# EAGLE design otb-8266 (EAGLE 7.4.0)
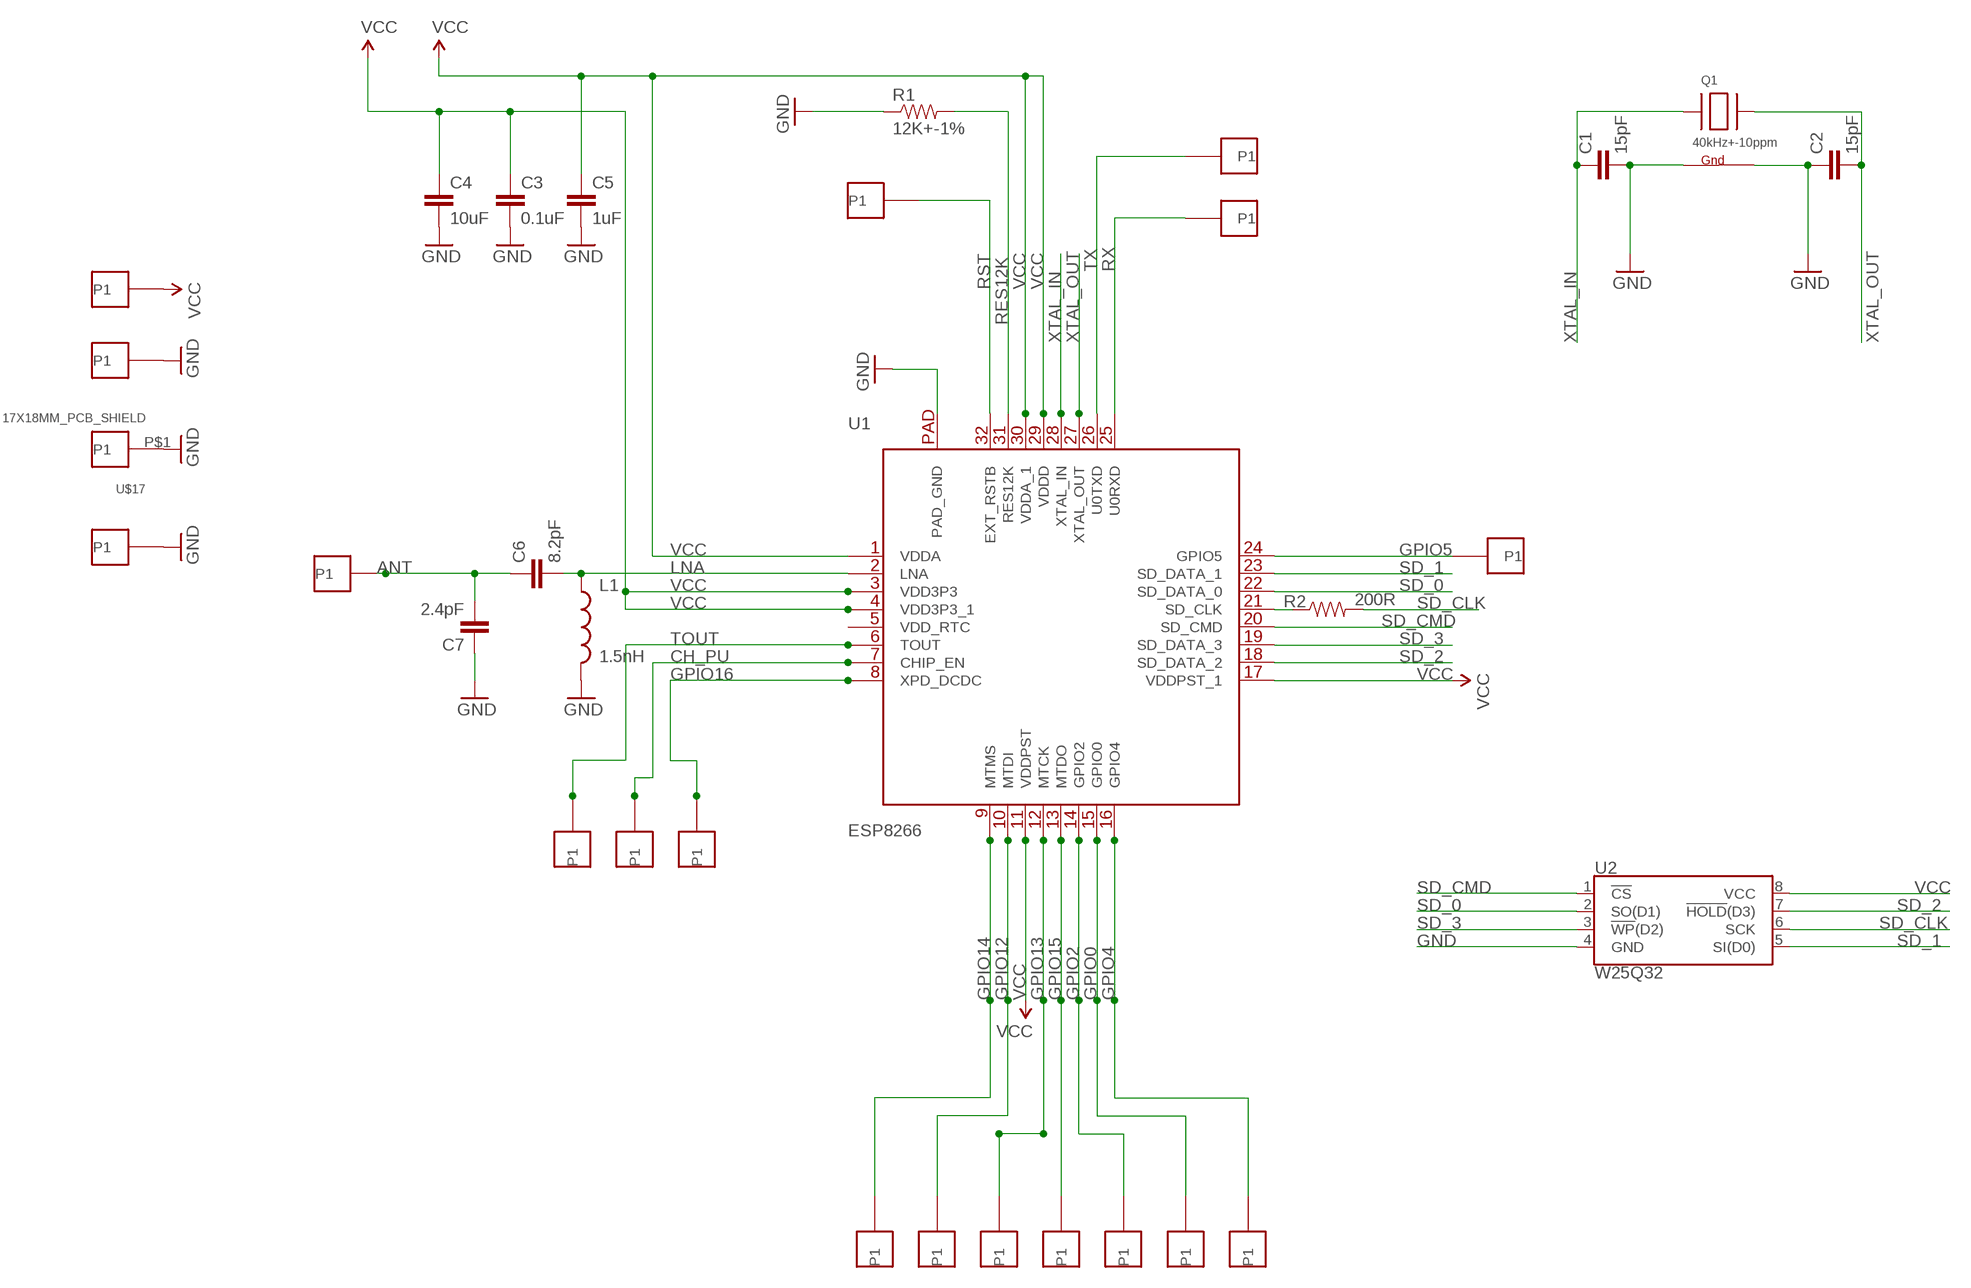
[diagram p0: schematic, sheet 1]

## Parts
C1  15pF  CAP0402-CAP  [0402-CAP]
C2  15pF  CAP0402-CAP  [0402-CAP]
C3  0.1uF  CAP0402-CAP  [0402-CAP]
C4  10uF  CAP0603-CAP  [0603-CAP]
C5  1uF  CAP0603-CAP  [0603-CAP]
C6  8.2pF  CAP0402-CAP  [0402-CAP]
C7  2.4pF  CAP0402-CAP  [0402-CAP]
L1  1.5nH  INDUCTOR0402  [C0402]
Q1  40kHz+-10ppm  XTAL-4-3225  [NX3225]
R1  12K+-1%  RESISTOR0402-RES  [0402-RES]
R2  200R  RESISTOR0402-RES  [0402-RES]
U1  ESP8266  [QFN32]
U2  W25Q32  W25Q32FVSS  [SOIC-8]
U$1  1.27MM_PITCH_PLATED_HOLE  [1.27MM_PITCH_PLATED_HOLE]
U$2  1.27MM_PITCH_PLATED_HOLE  [1.27MM_PITCH_PLATED_HOLE]
U$3  1.27MM_PITCH_PLATED_HOLE  [1.27MM_PITCH_PLATED_HOLE]
U$4  1.27MM_PITCH_PLATED_HOLE  [1.27MM_PITCH_PLATED_HOLE]
U$5  1.27MM_PITCH_PLATED_HOLE  [1.27MM_PITCH_PLATED_HOLE]
U$6  1.27MM_PITCH_PLATED_HOLE  [1.27MM_PITCH_PLATED_HOLE]
U$7  1.27MM_PITCH_PLATED_HOLE  [1.27MM_PITCH_PLATED_HOLE]
U$8  1.27MM_PITCH_PLATED_HOLE  [1.27MM_PITCH_PLATED_HOLE]
U$9  1.27MM_PITCH_PLATED_HOLE  [1.27MM_PITCH_PLATED_HOLE]
U$10  1.27MM_PITCH_PLATED_HOLE  [1.27MM_PITCH_PLATED_HOLE]
U$11  1.27MM_PITCH_PLATED_HOLE  [1.27MM_PITCH_PLATED_HOLE]
U$12  1.27MM_PITCH_PLATED_HOLE  [1.27MM_PITCH_PLATED_HOLE]
U$13  1.27MM_PITCH_PLATED_HOLE  [1.27MM_PITCH_PLATED_HOLE]
U$14  1.27MM_PITCH_PLATED_HOLE  [1.27MM_PITCH_PLATED_HOLE]
U$15  1.27MM_PITCH_PLATED_HOLE  [1.27MM_PITCH_PLATED_HOLE]
U$16  1.27MM_PITCH_PLATED_HOLE  [1.27MM_PITCH_PLATED_HOLE]
U$17  17X18MM_PCB_SHIELD  [17X18_SHIELD]
U$18  1.27MM_PITCH_PLATED_HOLE  [1.27MM_PITCH_PLATED_HOLE]
U$19  1.27MM_PITCH_PLATED_HOLE  [1.27MM_PITCH_PLATED_HOLE]

## Nets
ANT: C6.1 C7.2 U$16.P1
CH_PU: U1.7(CHIP_EN) U$4.P1
GND: C1.2 C2.1 C3.2 C4.2 C5.2 C7.1 L1.2 Q1.2(G2) Q1.4(G1) R1.1 U1.EP(PAD_GND) U2.4(GND) U$2.P1 U$17.P$1(P1) U$19.P1
GPIO0: U1.15(GPIO0) U$11.P1
GPIO2: U1.14(GPIO2) U$10.P1
GPIO4: U1.16(GPIO4) U$12.P1
GPIO5: U1.24(GPIO5) U$18.P1
GPIO12: U1.10(MTDI) U$7.P1
GPIO13: U1.12(MTCK) U$8.P1
GPIO14: U1.9(MTMS) U$6.P1
GPIO15: U1.13(MTDO) U$9.P1
GPIO16: U1.8(XPD_DCDC) U$5.P1
LNA: C6.2 L1.1 U1.2(LNA)
N$2: R2.1 U1.21(SD_CLK)
RES12K: R1.2 U1.31(RES12K)
RST: U1.32(EXT_RSTB) U$15.P1
RX: U1.25(U0RXD) U$13.P1
SD_0: U1.22(SD_DATA_0) U2.2(SO(D1))
SD_1: U1.23(SD_DATA_1) U2.5(SI(D0))
SD_2: U1.18(SD_DATA_2) U2.7(!HOLD!(D3))
SD_3: U1.19(SD_DATA_3) U2.3(!WP!(D2))
SD_CLK: R2.2 U2.6(SCK)
SD_CMD: U1.20(SD_CMD) U2.1(!CS!)
TOUT: U1.6(TOUT) U$3.P1
TX: U1.26(U0TXD) U$14.P1
VCC: C3.1 C4.1 C5.1 U1.1(VDDA) U1.3(VDD3P3) U1.4(VDD3P3_1) U1.11(VDDPST) U1.17(VDDPST_1) U1.29(VDDD) U1.30(VDDA_1) U2.8(VCC) U$1.P1
XTAL_IN: C1.1 Q1.1(X1) U1.28(XTAL_IN)
XTAL_OUT: C2.2 Q1.3(X2) U1.27(XTAL_OUT)
Unconnected: U1.5(VDD_RTC)

## Library data of the parts
C1-C3 C6 C7 = SparkFun-Passives:CAP: Capacitor Standard 0603 ceramic capacitor, and 0.1" leaded capacitor.
C4 C5 = SparkFun-Capacitors:CAP: Capacitor Standard 0603 ceramic capacitor, and 0.1" leaded capacitor.
L1 = SparkFun-Passives:INDUCTOR: Inductors Basic Inductor/Choke - 0603 and 1206. Footprints are not proven and vary greatly between part numbers. INDUCTOR POWER 3.3UH 4.0A SMD 0.197" L x 0.197" W x 0.177" H (5.00mm x 5.00mm x 4.50mm)
Q1 = adafruit:XTAL-4: Classic 4-pin 3.2 x 2.5mm crystal
R1 R2 = SparkFun-Passives:RESISTOR: Resistor Basic schematic elements and footprints for 0603, 1206, and PTH resistors.
U1 = Piers's library:ESP8266: Espressif ESP8266 WiFi Smart Connectivity Platform.; PROD_ID: IC-12452
U2 = SparkFun-DigitalIC:W25Q32FV: Winbond W25Q32FV 32Mbit (4MB) Flash The W25Q32FV support the standard Serial Peripheral Interface (SPI), Dual/Quad I/O SPI as well as 2-clocks instruction cycle Quad Peripheral Interface (QPI). Datasheet <http://www.winbond.com/resource-files/w25q32fv%20revh%20091613.pdf>; PROD_ID: IC-13229
U$1-U$16 U$18 U$19 = Piers's library:1.27MM_PITCH_PLATED_HOLE
U$17 = Piers's library:17X18MM_PCB_SHIELD

## Board
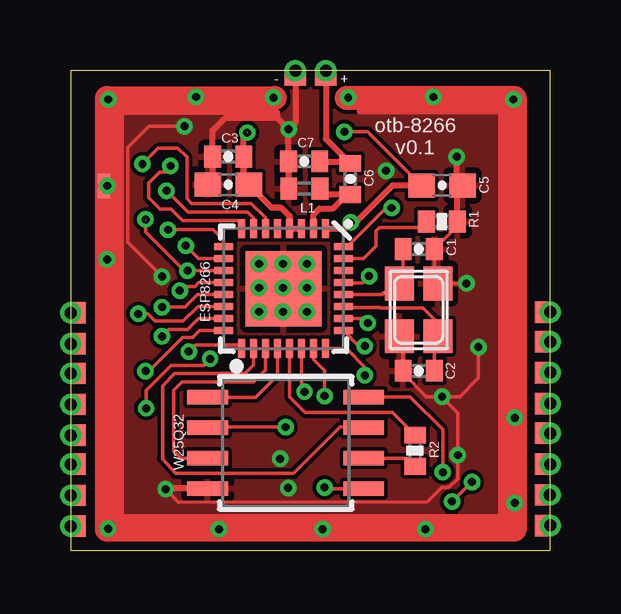
[diagram p1: board, top side]
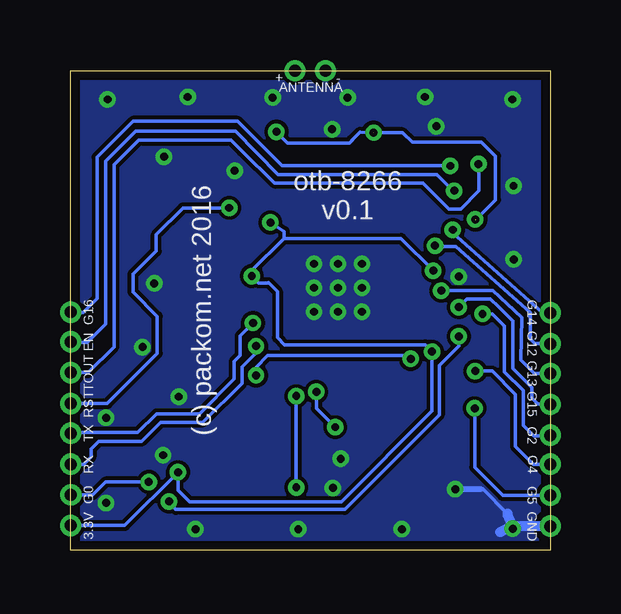
[diagram p2: board, bottom side, seen from below]

Size 20 x 20 mm. Coordinates in mm from the lower left corner, seen from the top.
Outline: 0,0 20,0 20,20 0,20 0,0
Copper layers (1*16): Top 0.0356mm / dielectric 1.5011mm / Bottom 0.0356mm
Design rules "LaenPCBOrder": minimum track width 6mil, minimum drill 13mil, track to track 6mil, track to pad 6mil, pad to pad 6mil, via to via 6mil, smd to smd 6mil, copper to edge 15mil, drill to drill 6mil, minimum pad ring 7mil, minimum via ring 7mil, stop-mask expansion 3mil, vias tented up to drill 0mil, thermal gap 10mil

### Footprints (pad centres in the part's own frame; a part is rotated, then mirrored left to right if it is on the bottom)
0402-CAP = smd 0.7 x 0.9: 1 -0.65,0; 2 0.65,0
0603-CAP = smd 1.1 x 1: 1 -0.85,0; 2 0.85,0
C0402 = smd 0.7 x 0.9: 1 -0.65,0; 2 0.65,0
NX3225 = smd 1.4 x 1.2: 1 -1.1,-0.8; 2 1.1,-0.8; 3 1.1,0.8; 4 -1.1,0.8
0402-RES = smd 0.7 x 0.9: 1 -0.65,0; 2 0.65,0
QFN32 = smd 0.8 x 0.285: 1 -2.5,1.75; 2 -2.5,1.25; 3 -2.5,0.75; 4 -2.5,0.25; 5 -2.5,-0.25; 6 -2.5,-0.75; 7 -2.5,-1.25; 8 -2.5,-1.75; 17 2.5,-1.75; 18 2.5,-1.25; 19 2.5,-0.75; 20 2.5,-0.25; 21 2.5,0.25; 22 2.5,0.75; 23 2.5,1.25; 24 2.5,1.75 | smd 0.285 x 0.8: 9 -1.75,-2.5; 10 -1.25,-2.5; 11 -0.75,-2.5; 12 -0.25,-2.5; 13 0.25,-2.5; 14 0.75,-2.5; 15 1.25,-2.5; 16 1.75,-2.5; 25 1.75,2.5; 26 1.25,2.5; 27 0.75,2.5; 28 0.25,2.5; 29 -0.25,2.5; 30 -0.75,2.5; 31 -1.25,2.5; 32 -1.75,2.5 | smd 3.15 x 3.15: EP 0,0
SOIC-8 = smd 0.61 x 1.702: 1 -1.905,-3.251; 2 -0.635,-3.251; 3 0.635,-3.251; 4 1.905,-3.251; 5 1.905,3.251; 6 0.635,3.251; 7 -0.635,3.251; 8 -1.905,3.251
1.27MM_PITCH_PLATED_HOLE = drill 0.5 pad 0.889: P1 0,0 | smd 0.635 x 0.889: P$1 0.318,0
17X18_SHIELD = smd 0.508 x 1.016: P$1 -8.62,5.35

### Placement (x,y rotation side)
C1  14.52,12.56 0 top
C2  14.52,7.48 0 top
C3  6.57,16.41 180 top
C4  6.57,15.25 180 top
C5  15.49,15.21 0 top
C6  11.66,15.48 270 top
C7  9.74,16.21 0 top
L1  9.74,15.08 180 top
Q1  14.52,10.02 270 top
R1  15.48,13.7 180 top
R2  14.37,4.15 270 top
U1  8.88,10.91 270 top
U2  8.97,4.47 270 top
U$1  20,1.03 180 top
U$2  0,1 0 top
U$3  20,7.4 180 top
U$4  20,8.69 180 top
U$5  20,9.93 180 top
U$6  0,9.9 0 top
U$7  0,8.61 0 top
U$8  0,7.37 0 top
U$9  0,6.08 0 top
U$10  0,4.79 0 top
U$11  19.99,2.31 180 top
U$12  0,3.59 0 top
U$13  20,3.59 180 top
U$14  20,4.88 180 top
U$15  20,6.11 180 top
U$16  10.64,20 270 top
U$17  10.02,9.85 0 top
U$18  0,2.29 0 top
U$19  9.37,20 270 top

### Tracks (layer width: path | path; a pad name or v marks a point on that pad's centre or on a via)
ANT
  Top 0.254: C7.2 11.57,16.21 C6.1 10.65,17.14 U$16.P1
CH_PU  (via drill 0.33)
  Top 0.152: U1.7 7.63,13.86 7.38,14.11 4.89,14.11 4.76,14.23 v4,14.99
  Bottom 0.152: 4.05,14.99 v4,14.99 4.04,14.99 4.22,15.16 4.73,15.67 11.35,15.67 13.13,17.48 17.3,17.48 18.54,16.23 18.54,9.42 19.3,8.66 19.97,8.66 U$4.P1
GND  (via drill 0.33)
  Top 0.152: C2.1 13.87,8.77 Q1.2 13.79,8.92 13.87,8.84 13.87,7.37 14.83,6.4 v15.49,6.4 | v16.51,11.12 16.5,11.12 Q1.4 15.17,11.27 C1.2 16.13,13.52 R1.1 | v3.96,2.54 4.5,1.99 14.88,2.01 15.49,2.61 15.77,2.62 16.14,2.98 v16.14,3.96 16.14,5.71 15.49,6.38 v15.49,6.4 | v3.81,11.4 2.49,12.75 2.39,12.85 2.39,16.79 3.28,17.68 v4.75,17.68 | v15.49,6.4 16.23,6.4 17,7.18 v17,8.47 | 17.96,1.4 17.96,1.41 v18.52,1.97
  Top 0.254: U2.4 3.99,2.57 v3.96,2.54 | C4.2 5.92,15.44 C3.2 5.92,17.5 6.45,18.03 8.61,18.03 | L1.2 C7.1 9.09,17.58 v9.09,17.55 | C5.2 16.13,15 R1.1 16.13,15.21 16.1,15.24 v16.1,16.41 | 8.61,18.03 v9.09,17.55 | 12.06,18.29 17.96,18.29 17.96,1.4 2.08,1.4 2.08,18.26 8.61,18.26 8.61,18.03 | U$19.P1 9.37,17.83 v9.09,17.55
  Top 0.406: U$17.P$1 1.4,15.35 v1.53,15.19
  Bottom 0.152: 3.94,2.56 v3.96,2.54 | 2.9,2.54 3.98,2.54 3.99,2.53 3.99,2.55 4,2.56 2.82,2.56 1.78,1.52
  Bottom 0.254: 2.9,2.54 v3.96,2.54
  Bottom 0.406: 1.78,1.52 1.59,1.03 2.1,0.75 1.54,1 0.15,1 U$2.P1
  other vias: 7.85,11.94 8.85,11.94 9.85,11.94 9.85,10.94 8.85,10.94 7.85,10.94 7.85,9.94 8.85,9.94 9.85,9.94 1.57,18.8 18.46,18.8 1.56,0.89 10.51,0.87 6.19,0.87 14.8,0.87 18.52,5.52 8.45,18.87 11.57,18.87 15.12,18.9 5.22,18.9 1.52,12.12 13.16,15.82 8.74,3.81 9.07,2.59
  pour Bottom: 0,20 20,20 20,0 0,0
  pour Top: 0,20 20,20 20,19 20,0 0,0
GPIO0  (via drill 0.33)
  Top 0.152: U1.15 5.34,9.66 4.88,9.2 4.09,9.2 v3.81,8.91 | v15.9,2.03 15.93,2.03 v16.74,2.85
  Bottom 0.152: v3.81,8.91 3.81,8.51 4.62,7.7 4.62,5.64 8.56,1.7 15.62,1.7 v15.9,2.03 | v16.74,2.85 18.54,2.85 19.07,2.31 U$11.P1
GPIO2  (via drill 0.33)
  Top 0.152: U1.14 5.31,10.16 4.7,9.55 3.53,9.55 3.23,9.86 v2.82,9.86
  Bottom 0.152: v2.82,9.86 2.41,9.86 1.91,9.35 1.91,7.44 1.12,6.66 1.12,5.21 0.69,4.78 0.02,4.78 U$10.P1
GPIO4  (via drill 0.33)
  Top 0.152: U1.16 5.37,9.16 5.08,8.87 4.67,8.87 3.28,7.47 v3.12,7.47
  Bottom 0.152: v3.12,7.47 2.41,7.47 1.45,6.5 1.45,4.32 0.71,3.58 U$12.P1
GPIO5  (via drill 0.33)
  Top 0.152: U1.24 11.51,8.41 12.27,7.62 v12.27,7.29 | v5.82,7.98 5.56,7.7 4.19,7.7 3.15,6.66 v3.15,5.92
  Bottom 0.152: v12.27,7.29 12.27,7.62 11.79,8.13 5.97,8.13 v5.82,7.98 | v3.15,5.92 3.15,3.45 1.98,2.29 U$18.P1
GPIO12  (via drill 0.33)
  Top 0.152: U1.10 5.34,12.16 v4.8,12.7
  Bottom 0.152: v4.8,12.7 4.8,12.67 3.93,12.67 0.84,9.91 0.84,8.81 0.64,8.61 U$7.P1
GPIO13  (via drill 0.33)
  Top 0.152: U1.12 5.34,11.16 5.18,11 4.72,11 v4.55,10.82
  Bottom 0.152: v4.55,10.82 2.39,10.82 1.19,9.7 1.22,7.92 0.66,7.37 U$8.P1
GPIO14  (via drill 0.33)
  Top 0.152: U1.9 6.38,12.93 5.94,13.36 v4.06,13.36
  Bottom 0.152: v4.06,13.36 4.06,13.22 0.33,9.91 0.33,9.9 U$6.P1
GPIO15  (via drill 0.33)
  Top 0.152: U1.13 5.3,10.66 4.78,10.13 v3.81,10.13
  Bottom 0.152: v3.81,10.13 3.48,10.46 2.49,10.46 2.13,10.13 1.55,9.55 1.55,7.57 0.76,6.78 0.76,6.35 0.51,6.1 0.01,6.1 U$9.P1
GPIO16  (via drill 0.33)
  Top 0.152: U1.8 7.13,13.62 7.04,13.74 4.67,13.74 4.19,14.22 3.73,14.22 3.25,14.71 3.25,15.32 3.71,15.77 3.91,15.77 v4.17,16.03
  Bottom 0.152: v4.17,16.03 11.18,16.03 13.03,17.88 17.4,17.88 18.9,16.38 18.9,10.49 19.48,9.91 19.98,9.91 U$5.P1
LNA
  Top 0.254: 10.13,14.81 L1.1 10.45,14.83 C6.2 11.53,14.83 10.95,14.25 10.39,14.25 10.13,13.99 U1.2
N$2
  Top 0.152: U1.21 9.13,6.39 9.78,5.74 13.43,5.74 R2.1
RES12K
  Top 0.152: U1.31 12.21,12.16 12.72,12.68 12.72,13.31 12.88,13.46 14.59,13.46 R1.2
RST  (via drill 0.33)
  Top 0.152: U1.32 11.54,12.66 13.16,14.28 v13.39,14.28
  Bottom 0.152: v13.39,14.28 15.32,14.28 16.43,13.16 16.43,12.47 17.4,11.51 17.4,10.77 16.38,9.75 16.38,8.2 18.47,6.11 U$15.P1
RX  (via drill 0.33)
  Top 0.152: U1.25 12.01,8.51 v12.27,8.51
  Bottom 0.152: v12.27,8.51 12.27,8.23 12.85,7.64 12.85,6.96 14.5,5.33 16.26,5.33 17.04,4.55 18.82,4.55 19.15,4.22 19.15,3.89 19.46,3.58 U$13.P1
SD_0  (via drill 0.33)
  Top 0.152: U1.22 9.63,6.73 v9.75,6.6 | v8.97,5.13 5.74,5.13 U2.2
  Bottom 0.152: v9.75,6.6 9.75,5.92 v8.97,5.13
SD_1  (via drill 0.33)
  Top 0.152: U1.23 10.13,7.96 10.59,7.49 v10.59,6.43 | v10.59,2.62 10.64,2.56 U2.5
  Bottom 0.152: v10.59,6.43 v10.59,2.62
SD_2
  Top 0.152: U1.18 7.63,7.73 7.26,7.37 4.34,7.37 3.83,6.86 3.83,3.81 4.37,3.2 9.3,3.2 11.23,5.13 12.2,5.13 U2.7
SD_3
  Top 0.152: U1.19 8.13,7.52 7.62,7.01 4.65,7.01 4.29,6.66 4.29,4.14 4.6,3.83 U2.3
SD_CLK
  Top 0.152: U2.6 14.03,3.84 R2.2
SD_CMD
  Top 0.152: U1.20 8.63,7.28 7.72,6.38 U2.1
TOUT  (via drill 0.33)
  Top 0.152: U1.6 8.13,13.87 7.53,14.46 5.04,14.46 4.85,14.66 4.85,16.38 4.47,16.76 3.66,16.76 v2.99,16.1
  Bottom 0.152: U$3.P1 19.27,7.4 18.19,8.48 18.19,16.08 17.17,17.09 13.31,17.09 12.85,16.64 11.51,15.32 5.31,15.32 4.22,14.22 3.73,14.22 2.97,14.99 2.97,16.08 v2.99,16.1
TX  (via drill 0.33)
  Top 0.152: U1.26 12.21,9.66 v12.39,9.47
  Bottom 0.152: v12.39,9.47 12.93,8.94 12.93,8.13 13.18,7.87 13.18,7.14 14.63,5.69 16.41,5.69 17.2,4.9 19.97,4.9 U$14.P1
VCC  (via drill 0.33)  (2 unrouted)
  Top 0.152: U1.11 v4.88,11.66 | v3.12,13.79 3.12,13.26 4.72,11.66 v4.88,11.66 | U1.30 U1.29 12.17,11.15 v12.45,11.43 | 14.63,15.22 C5.1 | v15.52,3.25 15.52,5.03 14.15,6.4 12.24,6.4 U2.8 | v4.88,11.66 | v11.42,17.45 12.37,17.45 14.66,15.19 | v4.93,8.28 5.21,8.56 6.98,8.56 U1.17
  Top 0.254: U1.4 U1.3 | U1.4 9.13,13.93 8.78,14.29 8.38,14.29 C4.1 7.22,15.38 C3.1 | U1.4 9.14,13.41 9.14,13.92 8.79,14.28 8.38,14.28 7.54,15.11 7.54,15.27 7.21,15.6 7.21,17.25 v7.37,17.41 | C5.1 13.44,15.21 11.89,13.66 v11.67,13.66 11.41,13.41 U1.1
  Bottom 0.152: 3.12,13.77 2.29,14.61 2.29,16.43 2.87,17.02 5.75,17.02 6.16,17.41 v7.38,17.41 7.94,17.42 8.27,17.11 8.26,17.11 8.38,16.98 10.95,16.98 v11.42,17.45 | 11.74,11.16 11.73,11.15 | 11.73,11.15 11.38,10.79 11.38,8.87 11.07,8.56 5.21,8.56 v4.93,8.28 4.93,5.82 8.71,2.01 15.04,2.01 15.52,2.49 v15.52,3.25 17.74,1.03 U$1.P1 | 11.1,13.01 6.22,13.01 v4.88,11.66 | 11.73,11.15 12.17,11.15 v12.45,11.43 12.45,11.66 11.1,13.01 | 11.1,13.01 11.1,13.3 v11.67,13.66
XTAL_IN
  Top 0.152: C1.1 13.87,11.27 Q1.1 12.95,10.66 U1.28
XTAL_OUT
  Top 0.152: C2.2 15.17,8.77 | 15.17,8.77 Q1.3 | 15.17,8.77 15.17,9.62 14.68,10.11 12.93,10.11 12.89,10.11 11.39,10.11 U1.27

### Text on the board
tPlace: otb-8266 / v0.1
tNames: - | +
bNames: + | - | ANTENNA | otb-8266 / v0.1 | G14 | (c) packom.net 2016 | G16 | G12 | EN | G13 | TOUT | G15 | RST | G2 | TX | G4 | RX | G5 | G0 | GND | 3.3V